# Altium schematic sheet Heat Controller.SchDoc
size A4
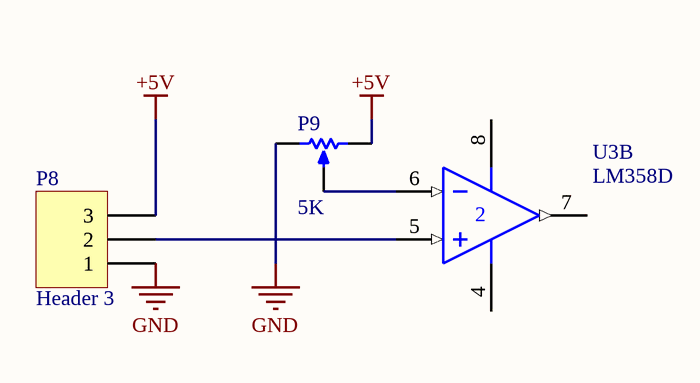
[diagram p0: Heat Controller.SchDoc]

## Parts
P8  Header 3  [HDR1X3]
P9  5K  [TRIMPOT-3296W]
U3  LM358D  [751-02_N]  (part B of 2)

## Nets
+5V: P8.3 P9.3(BOT)
GND: P8.1 P9.1(TOP)
NetP8_2: P8.2 U3.5(IN+)
NetP9_2: P9.2(TAP) U3.6(IN-)

Not connected (* = marked no-connect by the designer): U3 4(V-) 7(OUT) 8(V+)

## Library data of the parts
P8 = Header 3: Header, 3-Pin; LatestRevisionDate: 17-Jul-2002; LatestRevisionNote: Re-released for DXP Platform.; Publisher: Altium Limited
P9 = TRIMPOT
U3 = LM358D: Dual Low-Power Operational Amplifier; Published: 17-Jul-2002; LatestRevisionDate: 13-Apr-2006; LatestRevisionNote: IPC-7351 Footprint Added.; DatasheetVersion: 1988; PackageReference: 751-02; Publisher: Altium Limited; PackageDescription: 8-Pin Small Outline Integrated Circuit 1.27 mm Pitch; Code_JEDEC: MS-012-AA; Code_IPC: SOIC127P600-8; ComponentLink1Description: Manufacturer Link; ComponentLink1URL: http://www.onsemi.com/site/products/parametrics/0,4446,251,00.html; ComponentLink2Description: Datasheet; ComponentLink2URL: http://www.onsemi.com/pub/Collateral/LM358-D.PDF